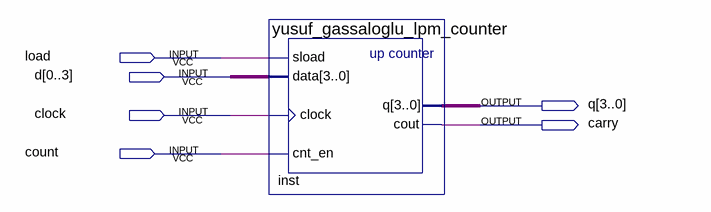
[diagram p0: schematic sheet]
// Quartus schematic yusuf_gassaloglu_2020510034_HW1_b.bdf as structural Verilog: 1 symbols, 6 pins
module yusuf_gassaloglu_2020510034_HW1_b (
  input  load,
  input  [0:3] d,
  input  clock,
  input  count,
  output [3:0] q,
  output carry
);

  yusuf_gassaloglu_lpm_counter inst (.sload(load), .data(d), .clock(clock), .cnt_en(count), .cout(carry), .q(q));
endmodule
